# EAGLE design ML612S_Breakout (EAGLE 9.6.2)
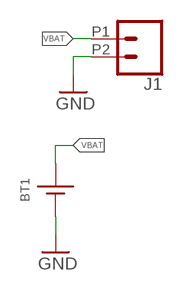
[diagram p0: schematic, sheet 1]

## Parts
BT1  BATTERY_COINML621  [ML621S]
J1  CONN_022.54_SCREW  [1X02_2.54_SCREWTERM]

## Nets
GND: BT1.- J1.P2
VBAT: BT1.+ J1.P1

## Library data of the parts
BT1 = bschulz:BATTERY_COIN: Coin Cell Battery Holder; DIGIKEY: P044-ND; MF: Panasonic; MPN: ML-621S/DN
J1 = bschulz:CONN_02: Genaric 2 terminal header SCREW_2.54 <https://www.digikey.com/product-detail/en/on-shore-technology-inc/OSTVN02A150/ED10561-ND/1588862> 39532_RA <https://www.digikey.com/product-detail/en/molex/0395321002/WM7845-ND/1280696>; DIGIKEY: ED10561-ND; MF: OnShore; MPN: OSTVN02A150

## Board
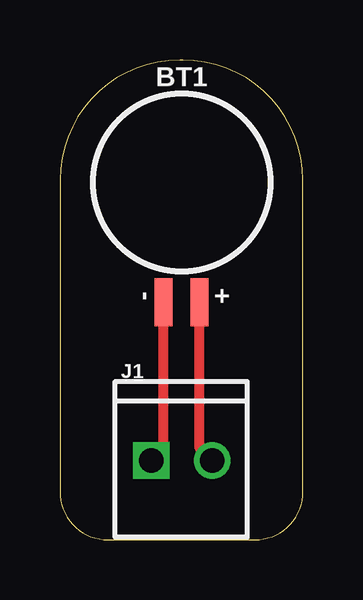
[diagram p1: board, top side]

Size 10.14 x 19.99 mm. Coordinates in mm from the lower left corner, seen from the top.
Outline: 0,14.99 0,2 arc90 2,0 8.14,0 arc90 10.14,2 10.14,14.99 arc90 5.14,19.99 5,19.99 arc90 0,14.99
Copper layers (1*16): Top 0.035mm / dielectric 1.5mm / Bottom 0.035mm
Design rules "default": minimum track width 6mil, minimum drill 0.35mm, track to track 6mil, track to pad 6mil, pad to pad 6mil, via to via 6mil, smd to smd 6mil, copper to edge 40mil, drill to drill 6mil, minimum pad ring 10mil, minimum via ring 8mil, stop-mask expansion 4mil, vias tented up to drill 0mil, thermal gap 10mil

### Footprints (pad centres in the part's own frame; a part is rotated, then mirrored left to right if it is on the bottom)
ML621S = smd 0.75 x 2: + 0.75,1; - -0.75,1
1X02_2.54_SCREWTERM = drill 1.016: P1 1.27,0 | drill 1.016 square: P2 -1.27,0

### Placement (x,y rotation side)
BT1  5.08,8.89 0 top
J1  5.08,3.3 0 top

### Tracks (layer width: path | path; a pad name or v marks a point on that pad's centre or on a via)
GND
  Top 0.406: J1.P2 4.33,3.82 BT1.-
VBAT
  Top 0.406: J1.P1 5.83,3.82 BT1.+

### Text on the board
tDocu: - | +
bDocu: Break44 / ML-612S Breakout / B. Schulz